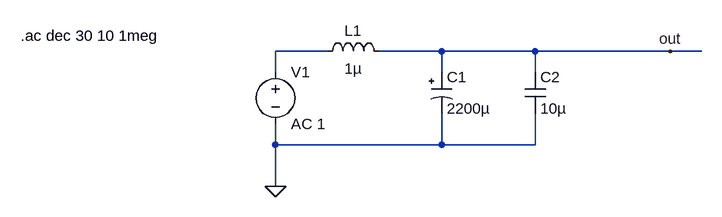
[diagram p0: schematic lcfilter.asc]
lcfilter.asc, the LTspice schematic file:
Version 4
SHEET 1 880 680
WIRE 128 112 48 112
WIRE 304 112 208 112
WIRE 448 112 304 112
WIRE 656 112 448 112
WIRE 704 112 656 112
WIRE 48 144 48 112
WIRE 304 144 304 112
WIRE 448 144 448 112
WIRE 48 256 48 224
WIRE 304 256 304 208
WIRE 304 256 48 256
WIRE 448 256 448 208
WIRE 448 256 304 256
WIRE 48 320 48 256
FLAG 48 320 0
FLAG 656 112 out
SYMBOL polcap 288 144 R0
WINDOW 3 24 56 Left 2
SYMATTR Value 2200µ
SYMATTR InstName C1
SYMATTR Description Capacitor
SYMATTR Type cap
SYMATTR SpiceLine V=10 Irms=1.6 Rser=0.039 Lser=0 mfg="Nichicon" pn="UPL1A222MRH6" type="Al electrolytic"
SYMBOL cap 432 144 R0
SYMATTR InstName C2
SYMATTR Value 10µ
SYMATTR SpiceLine V=50 Irms=0 Rser=0.00342327 Lser=799p mfg="Würth Elektronik" pn="885012108022 WCAP-CSGP 1206" type="X5R"
SYMBOL voltage 48 128 R0
WINDOW 123 0 0 Left 0
WINDOW 39 0 0 Left 0
SYMATTR InstName V1
SYMATTR Value AC 1
SYMBOL ind 112 128 R270
WINDOW 0 32 56 VTop 2
WINDOW 3 5 56 VBottom 2
SYMATTR InstName L1
SYMATTR Value 1µ
SYMATTR SpiceLine Rser=0.1
TEXT -344 88 Left 2 !.ac dec 30 10 1meg

The netlist it stands for:
* lcfilter.asc
C1 out 0 2200µ V=10 Irms=1.6 Rser=0.039 Lser=0 mfg="Nichicon" pn="UPL1A222MRH6" type="Al electrolytic"
C2 out 0 10µ V=50 Irms=0 Rser=0.00342327 Lser=799p mfg="Würth Elektronik" pn="885012108022 WCAP-CSGP 1206" type="X5R"
V1 N001 0 AC 1
L1 N001 out 1µ Rser=0.1
.ac dec 30 10 1meg
.backanno
.end